# EAGLE design output_board (EAGLE 9.0.1)
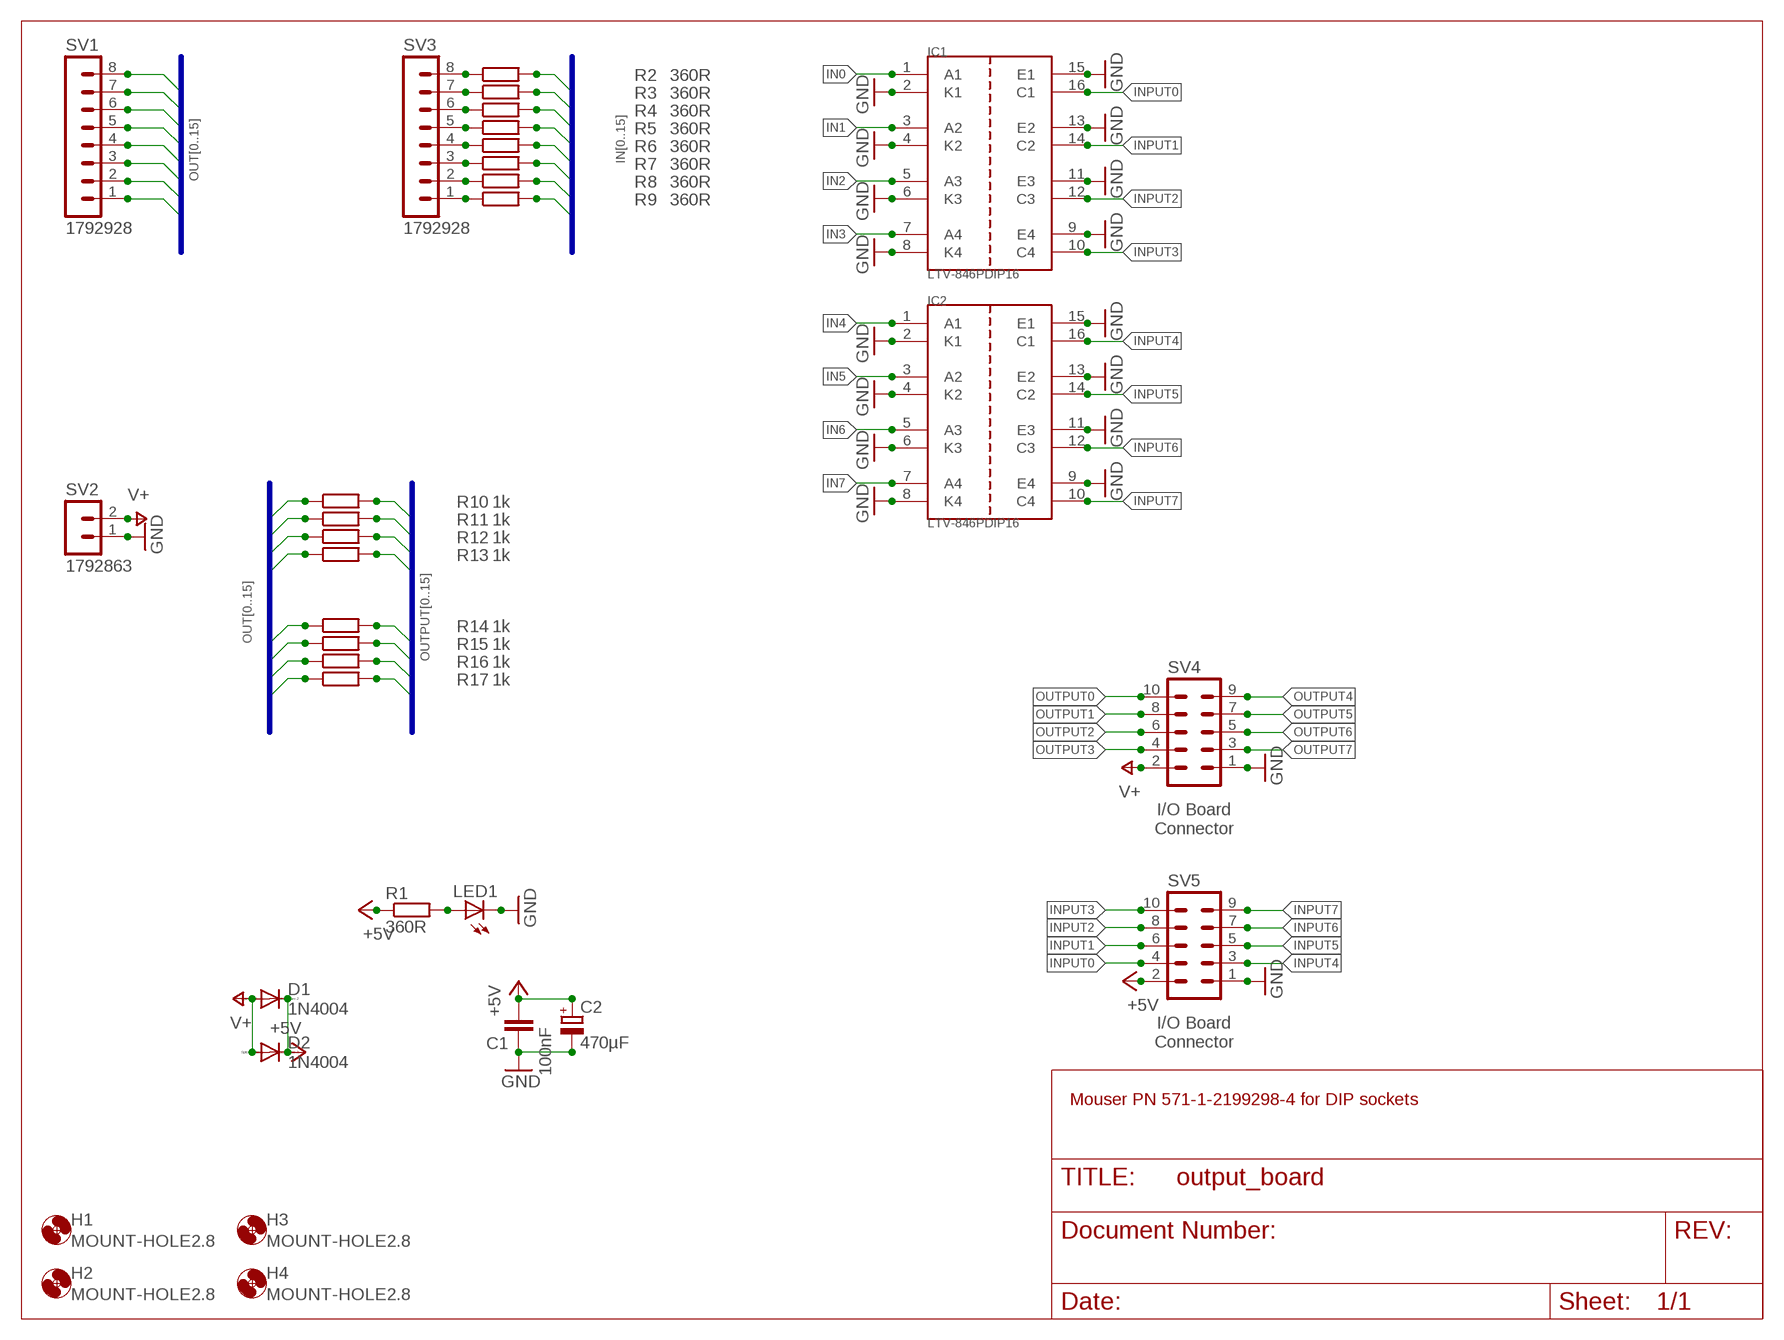
[diagram p0: schematic, sheet 1]

## Parts
C1  100nF  C-EUC0805  [C0805]
C2  470µF  CPOL-EUE5-10.5  [E5-10,5]
D1  1N4004  [DO41-10]
D2  1N4004  [DO41-10]
H1  MOUNT-HOLE2.8  [2,8]
H2  MOUNT-HOLE2.8  [2,8]
H3  MOUNT-HOLE2.8  [2,8]
H4  MOUNT-HOLE2.8  [2,8]
IC1  LTV-846PDIP16  [DIL16]
IC2  LTV-846PDIP16  [DIL16]
LED1  LEDCHIPLED_1206  [CHIPLED_1206]
R1  360R  R-EU_M0805  [M0805]
R2  360R  R-EU_M0805  [M0805]
R3  360R  R-EU_M0805  [M0805]
R4  360R  R-EU_M0805  [M0805]
R5  360R  R-EU_M0805  [M0805]
R6  360R  R-EU_M0805  [M0805]
R7  360R  R-EU_M0805  [M0805]
R8  360R  R-EU_M0805  [M0805]
R9  360R  R-EU_M0805  [M0805]
R10  1k  R-EU_M0805  [M0805]
R11  1k  R-EU_M0805  [M0805]
R12  1k  R-EU_M0805  [M0805]
R13  1k  R-EU_M0805  [M0805]
R14  1k  R-EU_M0805  [M0805]
R15  1k  R-EU_M0805  [M0805]
R16  1k  R-EU_M0805  [M0805]
R17  1k  R-EU_M0805  [M0805]
SV1  1792928  [1792928]
SV2  1792863  [1792863]
SV3  1792928  [1792928]
SV4  MA05-2  [MA05-2]
SV5  MA05-2  [MA05-2]

## Nets
+5V: C1.2 C2.+ D1.C D2.C R1.1 SV5.2
GND: C1.1 C2.- IC1.2(K1) IC1.4(K2) IC1.6(K3) IC1.8(K4) IC1.9(E4) IC1.11(E3) IC1.13(E2) IC1.15(E1) IC2.2(K1) IC2.4(K2) IC2.6(K3) IC2.8(K4) IC2.9(E4) IC2.11(E3) IC2.13(E2) IC2.15(E1) LED1.C SV2.1 SV4.1 SV5.1
IN0: IC1.1(A1) R9.2
IN1: IC1.3(A2) R8.2
IN2: IC1.5(A3) R7.2
IN3: IC1.7(A4) R6.2
IN4: IC2.1(A1) R5.2
IN5: IC2.3(A2) R4.2
IN6: IC2.5(A3) R3.2
IN7: IC2.7(A4) R2.2
INPUT0: IC1.16(C1) SV5.4
INPUT1: IC1.14(C2) SV5.6
INPUT2: IC1.12(C3) SV5.8
INPUT3: IC1.10(C4) SV5.10
INPUT4: IC2.16(C1) SV5.3
INPUT5: IC2.14(C2) SV5.5
INPUT6: IC2.12(C3) SV5.7
INPUT7: IC2.10(C4) SV5.9
N$1: LED1.A R1.2
N$2: R2.1 SV3.8
N$3: R3.1 SV3.7
N$4: R4.1 SV3.6
N$5: R5.1 SV3.5
N$6: R6.1 SV3.4
N$7: R7.1 SV3.3
N$8: R8.1 SV3.2
N$9: R9.1 SV3.1
OUT0: R10.1 SV1.1
OUT1: R11.1 SV1.2
OUT2: R12.1 SV1.3
OUT3: R13.1 SV1.4
OUT4: R14.1 SV1.5
OUT5: R15.1 SV1.6
OUT6: R16.1 SV1.7
OUT7: R17.1 SV1.8
OUTPUT0: R10.2 SV4.10
OUTPUT1: R11.2 SV4.8
OUTPUT2: R12.2 SV4.6
OUTPUT3: R13.2 SV4.4
OUTPUT4: R14.2 SV4.9
OUTPUT5: R15.2 SV4.7
OUTPUT6: R16.2 SV4.5
OUTPUT7: R17.2 SV4.3
V+: D1.A D2.A SV2.2 SV4.2

## Buses
IN[0..15]
OUT[0..15]
OUTPUT[0..15]

## Notes on the sheet
- I/O Board
  Connector
- I/O Board
  Connector
- Mouser PN 571-1-2199298-4 for DIP sockets

## Library data of the parts
C1 = rcl:C-EU: CAPACITOR, European symbol; MOUSER: 710-885012207072; SPICEPREFIX: C
C2 = rcl:CPOL-EU: POLARIZED CAPACITOR, European symbol; MOUSER: 598-477CKH016M; SPICEPREFIX: C
D1 D2 = diode:1N4004: DIODE general purpose rectifier, 1 A; MOUSER: 833-1N4004-TP
H1-H4 = holes:MOUNT-HOLE: MOUNTING HOLE with drill center marker
IC1 IC2 = lichtenstein_onion:LTV-846: LTV-846 – 4 Channel Optocoupler Information <https://www.mouser.com/ProductDetail/Lite-On/LTV-846?qs=sGAEpiMZZMteimceiIVCBx3Y662pemTNzbYJ80qgGrs%3d>; MOUSER: 859-LTV-846
LED1 = led:LED: LED OSRAM: - CHIPLED LG R971, LG N971, LY N971, LG Q971, LY Q971, LO R971, LY R971 LH N974, LH R974 LS Q976, LO Q976, LY Q976 LO Q996 - Hyper CHIPLED LW Q18S LB Q993, LB Q99A, LB R99A - SideLED LS A670, LO A670, LY A670, LG A670, LP A670 LB A673, LV A673, LT A673, LW A673 LH A674 LY A675 LS A676, LA A676, LO A676, LY A676, LW A676 LS A679, LY A679, LG A679 - Hyper Micro SIDELED® LS Y876, LA Y876, LO Y876, LY Y876 LT Y87S - SmartLED LW L88C, LW L88S LB L89C, LB L89S, LG L890 LS L89K, LO L89K, LY L89K LS L896, LA L896, LO L896, LY L896 - TOPLED LS T670, LO T670, LY T670, LG T670, LP T670 LSG T670, LSP T670, LSY T670, LOP T670, LYG T670 LG T671, LOG T671, LSG T671 LB T673, LV T673, LT T673, LW T673 LH T674 LS T676, LA T676, LO T676, LY T676, LB T676, LH T676, LSB T676, LW T676 LB T67C, LV T67C, LT T67C, LS T67K, LO T67K, LY T67K, LW E67C LS E67B, LA E67B, LO E67B, LY E67B, LB E67C, LV E67C, LT E67C LW T67C LS T679, LY T679, LG T679 LS T770, LO T770, LY T770, LG T770, LP T770 LB T773, LV T773, LT T773, LW T773 LH T774 LS E675, LA E675, LY E675, LS T675 LS T776, LA T776, LO T776, LY T776, LB T776 LHGB T686 LT T68C, LB T68C - Hyper Mini TOPLED® LB M676 - Mini TOPLED Santana® LG M470 LS M47K, LO M47K, LY M47K Source: http://www.osram.convergy.de LUXEON: - LUMILED® LXK2-PW12-R00, LXK2-PW12-S00, LXK2-PW14-U00, LXK2-PW14-V00 LXK2-PM12-R00, LXK2-PM12-S00, LXK2-PM14-U00 LXK2-PE12-Q00, LXK2-PE12-R00, LXK2-PE12-S00, LXK2-PE14-T00, LXK2-PE14-U00 LXK2-PB12-K00, LXK2-PB12-L00, LXK2-PB12-M00, LXK2-PB14-N00, LXK2-PB14-P00, LXK2-PB14-Q00 LXK2-PR12-L00, LXK2-PR12-M00, LXK2-PR14-Q00, LXK2-PR14-R00 LXK2-PD12-Q00, LXK2-PD12-R00, LXK2-PD12-S00 LXK2-PH12-R00, LXK2-PH12-S00 LXK2-PL12-P00, LXK2-PL12-Q00, LXK2-PL12-R00 Source: www.luxeon.com KINGBRIGHT: KA-3528ASYC Source: www.kingbright.com; MOUSER: 604-APTR3216YC
R1-R9 = rcl:R-EU_: RESISTOR, European symbol; MOUSER: 652-CR0805JW-361ELF; SPICEPREFIX: R
R10-R17 = rcl:R-EU_: RESISTOR, European symbol; MOUSER: 652-CR0805JW-102ELF; SPICEPREFIX: R
SV1 SV3 = lichtenstein_onion:1792928: PCB terminal block - PTS 1,5/ 8-5,0-H - 1792928 Information <https://www.phoenixcontact.com/online/portal/us?uri=pxc-oc-itemdetail:pid=1792928&library=usen&pdfmode=direct&pdflanguage=en>; MOUSER: 651-1792928
SV2 = lichtenstein_onion:1792863: PCB terminal block - PTS 1,5/ 2-5,0-H - 1792863 Information <https://www.phoenixcontact.com/online/portal/us?uri=pxc-oc-itemdetail:pid=1792863&library=usen&tab=1>; MOUSER: 651-1792863
SV4 SV5 = con-lstb:MA05-2: PIN HEADER; MOUSER: 517-30310-6002; OC_FARNELL: unknown; OC_NEWARK: unknown

## Board
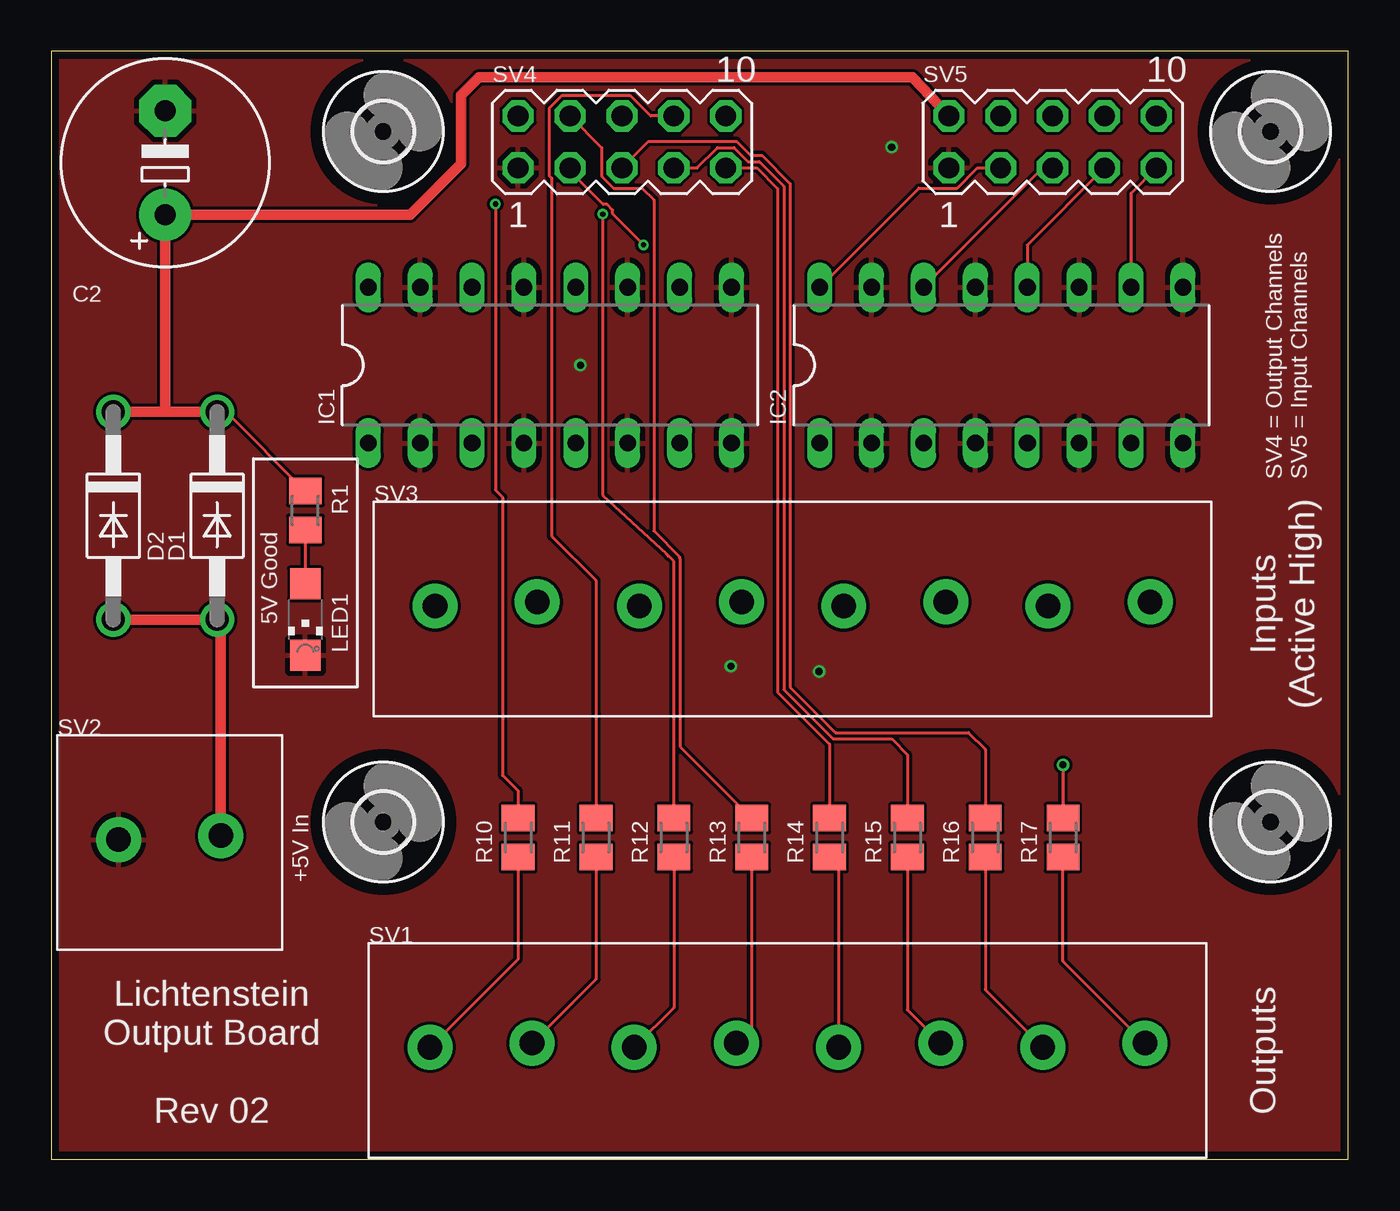
[diagram p1: board, top side]
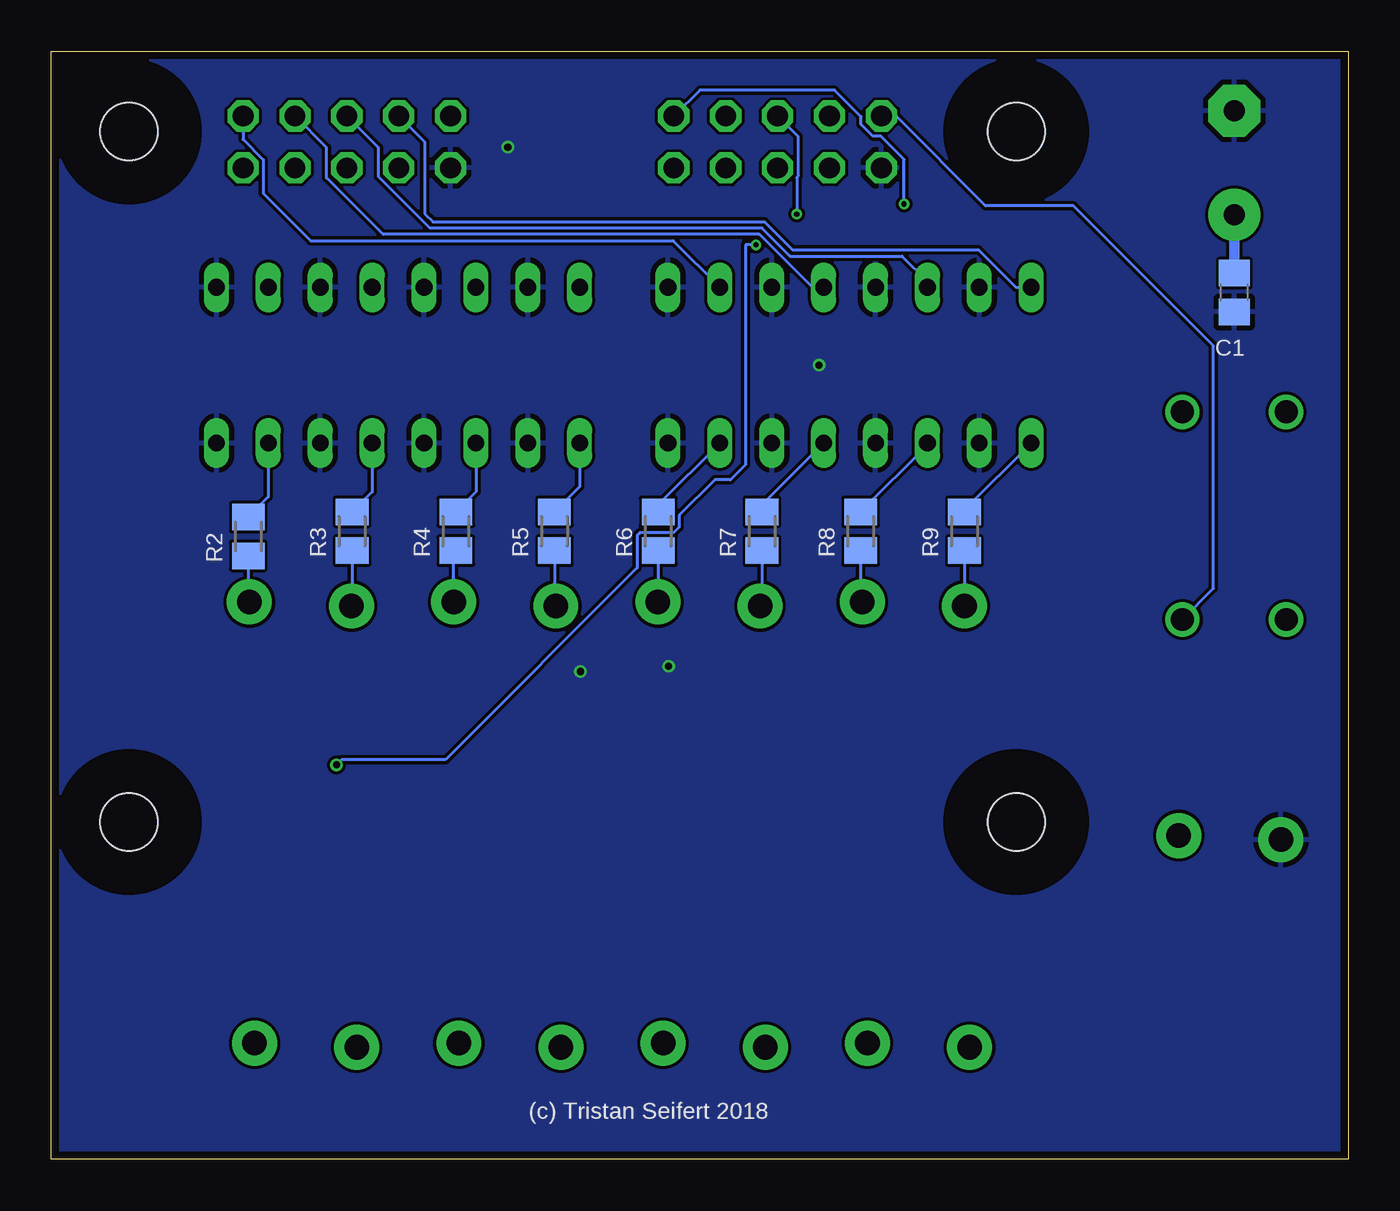
[diagram p2: board, bottom side, seen from below]

Size 63.5 x 54.23 mm. Coordinates in mm from the lower left corner, seen from the top.
Outline: 0,0 63.5,0 63.5,54.23 0,54.23 0,0
Copper layers (1*16): Top 0.035559375mm / dielectric 1.6mm / Bottom 0.035559375mm
Design rules "oshpark-2layer": minimum track width 6mil, minimum drill 10mil, track to track 6mil, track to pad 6mil, pad to pad 6mil, via to via 6mil, smd to smd 6mil, copper to edge 15mil, drill to drill 6mil, minimum pad ring 5mil, minimum via ring 5mil, stop-mask expansion 2.5mil, vias tented up to drill 0mil, thermal gap 10mil

### Footprints (pad centres in the part's own frame; a part is rotated, then mirrored left to right if it is on the bottom)
C0805 = smd 1.3 x 1.5: 1 -0.95,0; 2 0.95,0
E5-10,5 = drill 1.016 pad 2.54: + -2.54,0 | drill 1.016 pad 2.54 octagon: - 2.54,0
DO41-10 = drill 1.118: A 5.08,0; C -5.08,0
2,8 = hole 2.8: 0,0
DIL16 = drill 0.813 long: 1 -8.89,-3.81; 2 -6.35,-3.81; 3 -3.81,-3.81; 4 -1.27,-3.81; 5 1.27,-3.81; 6 3.81,-3.81; 7 6.35,-3.81; 8 8.89,-3.81; 9 8.89,3.81; 10 6.35,3.81; 11 3.81,3.81; 12 1.27,3.81; 13 -1.27,3.81; 14 -3.81,3.81; 15 -6.35,3.81; 16 -8.89,3.81
CHIPLED_1206 = smd 1.5 x 1.5: A 0,-1.75; C 0,1.75
M0805 = smd 1.3 x 1.6: 1 -0.95,0; 2 0.95,0
1792928 = drill 1.2 pad 2.2: 1 0,-0.1; 2 5,0.1; 3 10,-0.1; 4 15,0.1; 5 20,-0.1; 6 25,0.1; 7 30,-0.1; 8 35,0.1
1792863 = drill 1.2 pad 2.2: 1 0,-0.1; 2 5,0.1
MA05-2 = drill 1.016 octagon: 1 -5.08,-1.27; 2 -5.08,1.27; 3 -2.54,-1.27; 4 -2.54,1.27; 5 0,-1.27; 6 0,1.27; 7 2.54,-1.27; 8 2.54,1.27; 9 5.08,-1.27; 10 5.08,1.27

### Placement (x,y rotation side)
C1  5.59,42.42 90 bottom
C2  5.59,48.77 90 top
D1  8.13,31.5 270 top
D2  3.05,31.5 270 top
H1  59.69,16.51 0 top
H2  16.26,50.29 0 top
H3  59.69,50.29 0 top
H4  16.26,16.51 0 top
IC1  24.42,38.86 0 top
IC2  46.51,38.86 0 top
LED1  12.45,26.42 180 top
R1  12.45,31.75 270 top
R2  53.85,30.48 90 bottom
R3  48.77,30.73 90 bottom
R4  43.69,30.73 90 bottom
R5  38.86,30.73 90 bottom
R6  33.78,30.73 90 bottom
R7  28.7,30.73 90 bottom
R8  23.88,30.73 90 bottom
R9  18.8,30.73 90 bottom
R10  22.86,15.75 90 top
R11  26.67,15.75 90 top
R12  30.48,15.75 90 top
R13  34.29,15.75 90 top
R14  38.1,15.75 90 top
R15  41.91,15.75 90 top
R16  45.72,15.75 90 top
R17  49.53,15.75 90 top
SV1  18.54,5.59 0 top
SV2  3.3,15.75 0 top
SV3  18.8,27.18 0 top
SV4  27.94,49.78 0 top
SV5  49.02,49.78 0 top

### Tracks (layer width: path | path; a pad name or v marks a point on that pad's centre or on a via)
+5V  (via drill 0.35)
  Top 0.152: R1.1 8.57,36.58 D1.C
  Top 0.508: v3.05,36.51 D2.C 5.59,36.58 | D1.C v8.13,36.51 | 7.37,36.58 D1.C | SV5.2 42.16,52.96 20.95,52.96 20.07,52.07 20.07,48.71 17.58,46.23 C2.+ 5.59,36.58 | D1.C 5.59,36.58
  Bottom 0.508: C1.2 C2.+
GND  (via drill 0.35)
  other vias: 33.27,24.13 25.91,38.86 37.59,23.88 41.15,49.53
  pour Top: 0,54.36 0,0 63.5,0 63.5,54.36
  pour Bottom: 0,54.36 0,0 63.5,0 63.5,54.36
IN0
  Bottom 0.152: IC1.1 18.8,31.78 R9.2
IN1
  Bottom 0.152: IC1.3 20.61,34.95 R8.2
IN2
  Bottom 0.152: IC1.5 28.7,32.04 R7.2
IN3
  Bottom 0.152: IC1.7 33.78,32.04 R6.2
IN4
  Bottom 0.152: IC2.1 37.62,32.92 R5.2
IN5
  Bottom 0.152: IC2.3 42.7,32.67 R4.2
IN6
  Bottom 0.152: IC2.5 47.78,32.67 R3.2
IN7
  Bottom 0.152: IC2.7 52.86,32.41 R2.2
INPUT0
  Bottom 0.152: SV5.4 45.21,49.78 45.21,46.27 44.81,45.87 28.58,45.87 27.21,44.5 18.1,44.5 16.27,42.67 IC1.16
INPUT1
  Bottom 0.152: SV5.6 47.47,49.51 47.47,48.08 44.96,45.57 28.7,45.57 27.33,44.2 21.84,44.2 20.61,42.96 IC1.14
INPUT2
  Bottom 0.152: SV5.8 50.01,49.51 50.01,48.03 47.24,45.26 28.83,45.26 26.24,42.67 IC1.12
INPUT3
  Bottom 0.152: SV5.10 54.1,49.91 53.11,48.92 53.11,47.27 50.8,44.96 33.05,44.96 IC1.10
INPUT4
  Top 0.152: IC2.16 42.48,47.52 44.35,47.52 45.34,48.51 SV5.3
INPUT5
  Top 0.152: IC2.14 48.55,48.51 SV5.5
INPUT6
  Top 0.152: SV5.7 47.78,44.74 IC2.12
INPUT7
  Top 0.152: IC2.10 52.86,47.28 SV5.9
N$1
  Top 0.152: R1.2 LED1.A
N$2
  Bottom 0.152: R2.1 53.85,27.23 SV3.8
N$3
  Bottom 0.152: R3.1 48.77,27.21 SV3.7
N$4
  Bottom 0.152: SV3.6 43.8,29.68 R4.1
N$5
  Bottom 0.152: R5.1 38.86,27.24 SV3.5
N$6
  Bottom 0.152: R6.1 33.78,27.19 SV3.4
N$7
  Bottom 0.152: R7.1 28.7,27.27 SV3.3
N$8
  Bottom 0.152: R8.1 23.88,27.26 SV3.2
N$9
  Bottom 0.152: R9.1 SV3.1
OUT0
  Top 0.152: R10.1 22.86,9.81 SV1.1
OUT1
  Top 0.152: R11.1 26.67,8.82 SV1.2
OUT2
  Top 0.152: R12.1 30.48,7.43 SV1.3
OUT3
  Top 0.152: R13.1 34.29,6.44 SV1.4
OUT4
  Top 0.152: R14.1 38.54,14.36 SV1.5
OUT5
  Top 0.152: R15.1 41.91,7.32 SV1.6
OUT6
  Top 0.152: R16.1 45.72,8.31 SV1.7
OUT7
  Top 0.152: SV1.8 49.53,9.7 R17.1
OUTPUT0  (via drill 0.25)
  Top 0.152: v21.75,46.75 21.75,32.75 22.1,32.4 22.1,18.8 22.86,18.03 R10.2
  Bottom 0.152: v21.75,46.75 21.75,48.93 22.89,50.06 23.27,50.06 23.85,50.64 23.85,51.03 25.15,52.32 31.75,52.32 SV4.10
OUTPUT1
  Top 0.152: SV4.8 29.34,51.05 28.35,52.05 24.99,52.05 24.41,51.46 24.41,48.1 24.5,48.01 24.5,30.5 26.67,28.33 R11.2
OUTPUT2  (via drill 0.25)
  Top 0.152: 30.12,29.62 27,32.5 v27,46.25 | 30.12,29.62 30.25,29.5 | R12.2 30.48,29.26 30.12,29.62
  Bottom 0.152: v27,46.25 27,48.05 26.95,48.1 26.95,50.06 SV4.6
OUTPUT3
  Top 0.152: SV4.4 26.95,49.51 26.95,48.1 27.53,47.52 28.93,47.52 29.5,46.95 29.5,30.75 30.75,29.5 30.75,29.42 30.79,29.39 30.79,20.2 R13.2
OUTPUT4
  Top 0.152: 33.03,48.5 SV4.9 34.54,48.51 35.56,47.5 35.56,22.86 38.1,20.32 R14.2
OUTPUT5
  Top 0.152: SV4.7 31.62,48.51 32.61,49.51 33.43,49.51 34.12,48.82 34.67,48.82 35.87,47.62 35.87,22.99 38.28,20.57 41.15,20.57 41.91,19.81 R15.2
OUTPUT6
  Top 0.152: SV4.5 29.23,49.81 33.56,49.81 34.24,49.12 34.8,49.12 36.17,47.75 36.17,23.11 38.4,20.88 44.91,20.88 45.72,20.07 R16.2
OUTPUT7  (via drill 0.25, 0.35)
  Top 0.152: SV4.3 25.4,48.35 27.02,46.73 27.2,46.73 27.48,46.45 27.48,46.27 v29,44.75 | v49.53,19.3 R17.2
  Bottom 0.152: v29,44.75 29.5,44.75 29.5,34 30.25,33.25 31.01,33.25 32.75,31.51 32.75,30.94 33.03,30.66 34.68,30.66 34.81,30.53 34.81,28.94 44.2,19.56 49.28,19.56 v49.53,19.3
V+
  Top 0.508: 8.05,26.42 D1.A | D1.A D2.A | SV2.2 8.3,26.24 D1.A
  Bottom 0.152: SV4.2 22.16,51.05 17.76,46.66 13.46,46.66 6.6,39.8 6.6,27.94 D1.A

### Text on the board
tNames: SV4 = Output Channels / SV5 = Input Channels | 5V Good | Inputs / (Active High) | +5V In | Outputs | Lichtenstein / Output Board / / Rev 02
bNames: (c) Tristan Seifert 2018